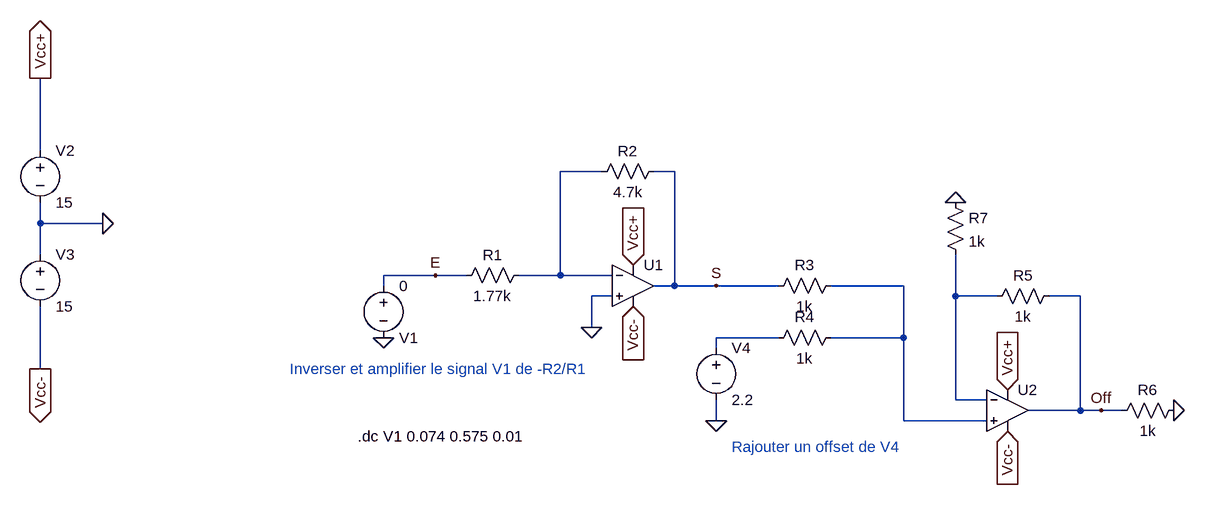
[diagram p0: schematic Conditionneur_1ereTentative.asc]
Conditionneur_1ereTentative.asc, the LTspice schematic file:
Version 4
SHEET 1 1624 680
WIRE -672 -48 -672 -160
WIRE 192 -16 128 -16
WIRE 304 -16 272 -16
WIRE -672 64 -672 32
WIRE -576 64 -672 64
WIRE -672 112 -672 64
WIRE -64 144 -144 144
WIRE -16 144 -64 144
WIRE 128 144 128 -16
WIRE 128 144 64 144
WIRE 208 144 128 144
WIRE -144 160 -144 144
WIRE 304 160 304 -16
WIRE 304 160 272 160
WIRE 368 160 304 160
WIRE 464 160 368 160
WIRE 656 160 544 160
WIRE 208 176 176 176
WIRE 736 176 736 112
WIRE 800 176 736 176
WIRE 928 176 880 176
WIRE 176 224 176 176
WIRE 464 240 368 240
WIRE 656 240 656 160
WIRE 656 240 544 240
WIRE 368 256 368 240
WIRE -672 288 -672 192
WIRE 736 336 736 176
WIRE 784 336 736 336
WIRE 928 352 928 176
WIRE 928 352 848 352
WIRE 960 352 928 352
WIRE 992 352 960 352
WIRE 368 368 368 336
WIRE 656 368 656 240
WIRE 784 368 656 368
FLAG 176 224 0
FLAG -144 240 0
FLAG -576 64 0
FLAG 240 128 Vcc+
IOPIN 240 128 In
FLAG 240 192 Vcc-
IOPIN 240 192 In
FLAG -672 -160 Vcc+
IOPIN -672 -160 Out
FLAG -672 288 Vcc-
IOPIN -672 288 Out
FLAG 368 160 S
FLAG 816 320 Vcc+
IOPIN 816 320 In
FLAG 816 384 Vcc-
IOPIN 816 384 In
FLAG 368 368 0
FLAG 1072 352 0
FLAG 960 352 Off
FLAG 736 32 0
FLAG -64 144 E
SYMBOL OpAmps\\UniversalOpAmp 240 160 R0
SYMATTR InstName U1
SYMBOL res 80 128 R90
WINDOW 0 0 56 VBottom 2
WINDOW 3 32 56 VTop 2
SYMATTR InstName R1
SYMATTR Value 1.77k
SYMBOL res 288 -32 R90
WINDOW 0 0 56 VBottom 2
WINDOW 3 32 56 VTop 2
SYMATTR InstName R2
SYMATTR Value 4.7k
SYMBOL voltage -672 -64 R0
WINDOW 123 0 0 Left 0
WINDOW 39 0 0 Left 0
SYMATTR InstName V2
SYMATTR Value 15
SYMBOL voltage -672 96 R0
WINDOW 123 0 0 Left 0
WINDOW 39 0 0 Left 0
SYMATTR InstName V3
SYMATTR Value 15
SYMBOL OpAmps\\UniversalOpAmp 816 352 R0
SYMATTR InstName U2
SYMBOL res 560 144 R90
WINDOW 0 0 56 VBottom 2
WINDOW 3 32 56 VTop 2
SYMATTR InstName R3
SYMATTR Value 1k
SYMBOL res 560 224 R90
WINDOW 0 0 56 VBottom 2
WINDOW 3 32 56 VTop 2
SYMATTR InstName R4
SYMATTR Value 1k
SYMBOL voltage 368 240 R0
WINDOW 123 0 0 Left 0
WINDOW 39 0 0 Left 0
SYMATTR InstName V4
SYMATTR Value 2.2
SYMBOL res 896 160 R90
WINDOW 0 0 56 VBottom 2
WINDOW 3 32 56 VTop 2
SYMATTR InstName R5
SYMATTR Value 1k
SYMBOL res 1088 336 R90
WINDOW 0 0 56 VBottom 2
WINDOW 3 32 56 VTop 2
SYMATTR InstName R6
SYMATTR Value 1k
SYMBOL voltage -144 144 R0
WINDOW 0 24 96 Left 2
WINDOW 3 24 16 Left 2
WINDOW 123 0 0 Left 0
WINDOW 39 0 0 Left 0
SYMATTR InstName V1
SYMATTR Value 0
SYMBOL res 720 16 R0
SYMATTR InstName R7
SYMATTR Value 1k
TEXT -184 392 Left 2 !.dc V1 0.074 0.575 0.01
TEXT 392 408 Left 2 ;Rajouter un offset de V4
TEXT -288 288 Left 2 ;Inverser et amplifier le signal V1 de -R2/R1

The netlist it stands for:
* Conditionneur_1ereTentative.asc
XU1 0 N001 Vcc+ Vcc- S level1 Avol=1Meg GBW=10Meg Vos=0 En=0 Enk=0 In=0 Ink=0 Rin=500Meg  ; pins In+ In- V+ V- OUT
R1 N001 E 1.77k
R2 S N001 4.7k
V2 Vcc+ 0 15
V3 0 Vcc- 15
XU2 N002 N003 Vcc+ Vcc- Off level1 Avol=1Meg GBW=10Meg Vos=0 En=0 Enk=0 In=0 Ink=0 Rin=500Meg  ; pins In+ In- V+ V- OUT
R3 N002 S 1k
R4 N002 N004 1k
V4 N004 0 2.2
R5 Off N003 1k
R6 0 Off 1k
V1 E 0 0
R7 0 N003 1k
.dc V1 0.074 0.575 0.01
* Rajouter un offset de V4
* Inverser et amplifier le signal V1 de -R2/R1
.lib UniversalOpAmp1.lib
.backanno
.end